# Altium schematic sheet PhotodiodeReceiverV1.SchDoc
size C; PageSetup: Record=PageOptions|CenterHorizontal=True|CenterVertical=True|PrintScale=1.06|XCorrection=1.00|YCorrection=1.00|PrintKind=1|BorderSize=5000000|LeftOffset=0|BottomOffset=0|Orientation=2|PaperLength=1000|PaperWidth=1000|Scale=100|PaperSource=7|PrintQuality=-3|MediaType=1|DitherType=10|PrintScaleMode=1|PaperKind=A3|PaperIndex=8
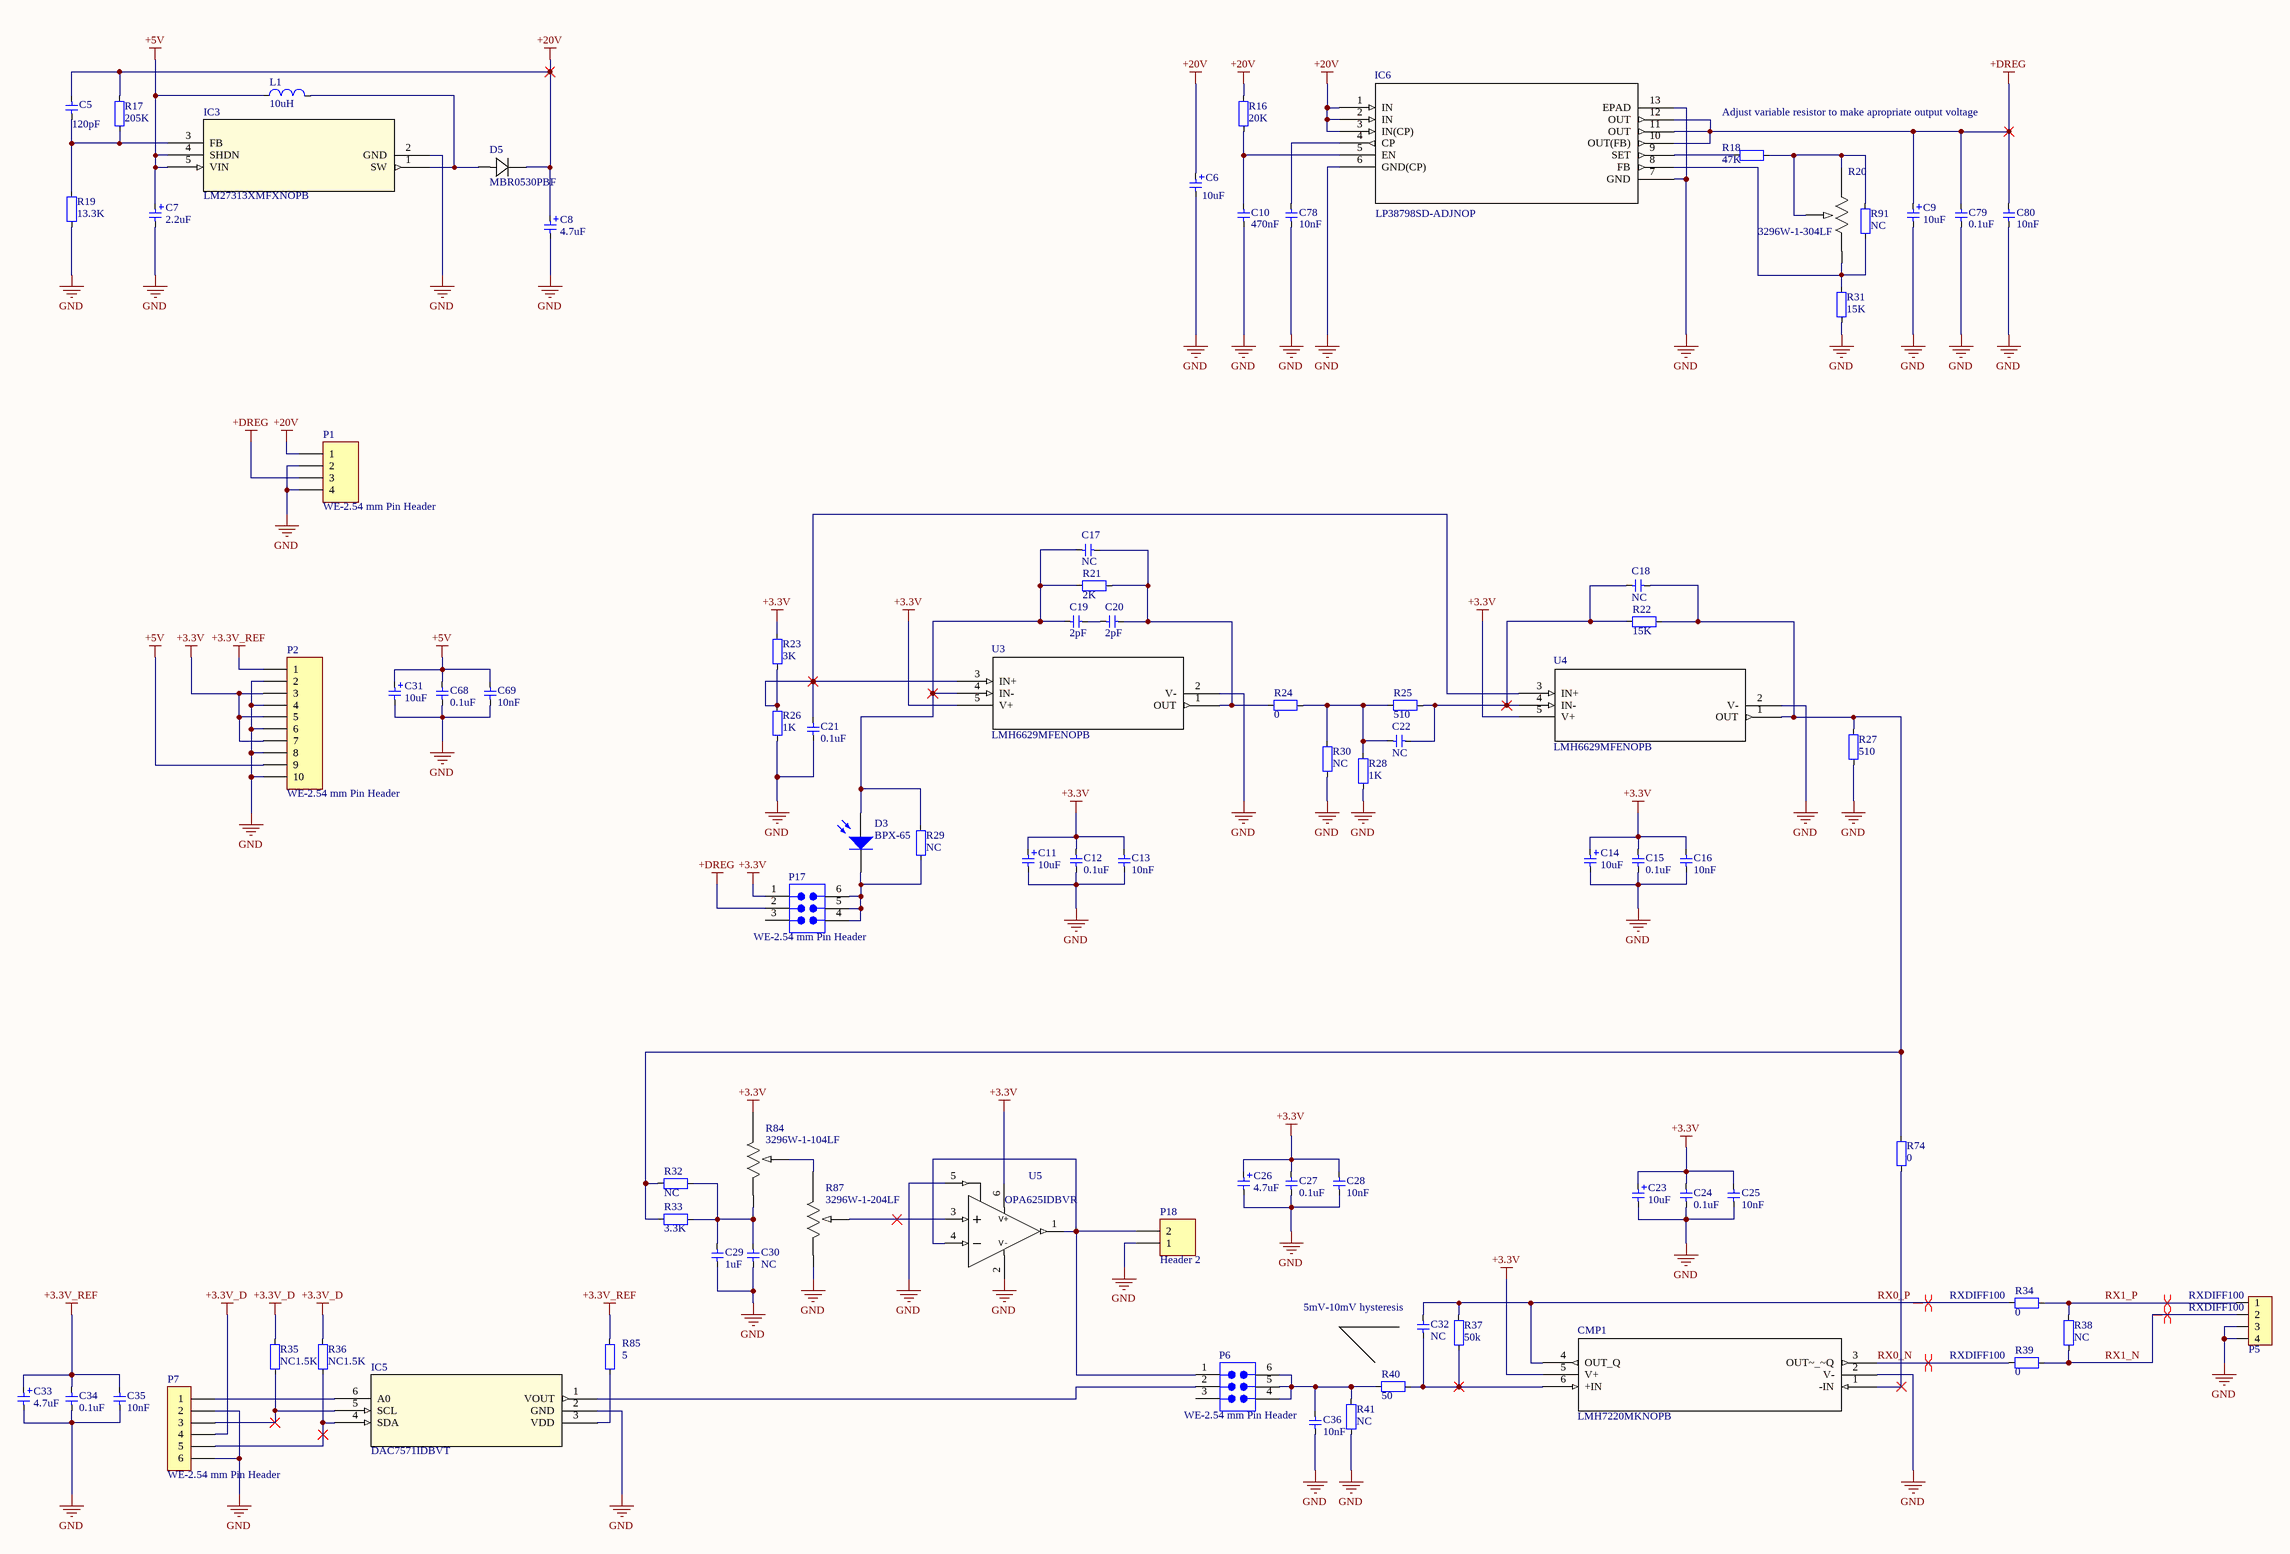
[diagram p0: PhotodiodeReceiverV1.SchDoc]

## Parts
C5  value 120pF  [CAP_0603]  (hidden comment: Cap_0603)
C6  value 10uF  [CAP_TAN_A1206]  (hidden comment: Cap_Tan_1206)
C7  value 2.2uF  [CAP_TAN_A1206]  (hidden comment: Cap_Tan_1206)
C8  value 4.7uF  [CAP_TAN_A1206]  (hidden comment: Cap_Tan_1206)
C9  value 10uF  [CAP_TAN_A1206]  (hidden comment: Cap_Tan_1206)
C10  value 470nF  [CAP_0805]  (hidden comment: Cap_0805)
C11  value 10uF  [CAP_TAN_A1206]  (hidden comment: Cap_Tan_1206)
C12  value 0.1uF  [CAP_0603]  (hidden comment: Cap_0603)
C13  value 10nF  [CAP_0603]  (hidden comment: Cap_0603)
C14  value 10uF  [CAP_TAN_A1206]  (hidden comment: Cap_Tan_1206)
C15  value 0.1uF  [CAP_0603]  (hidden comment: Cap_0603)
C16  value 10nF  [CAP_0603]  (hidden comment: Cap_0603)
C17  value NC  [CAP_0603]  (hidden comment: Cap_0603)
C18  value NC  [CAP_0603]  (hidden comment: Cap_0603)
C19  value 2pF  [CAP_0603]  (hidden comment: Cap_0603)
C20  value 2pF  [CAP_0603]  (hidden comment: Cap_0603)
C21  value 0.1uF  [CAP_0603]  (hidden comment: Cap_0603)
C22  value NC  [CAP_0603]  (hidden comment: Cap_0603)
C23  value 10uF  [CAP_TAN_A1206]  (hidden comment: Cap_Tan_1206)
C24  value 0.1uF  [CAP_0603]  (hidden comment: Cap_0603)
C25  value 10nF  [CAP_0603]  (hidden comment: Cap_0603)
C26  value 4.7uF  [CAP_TAN_A1206]  (hidden comment: Cap_Tan_1206)
C27  value 0.1uF  [CAP_0603]  (hidden comment: Cap_0603)
C28  value 10nF  [CAP_0603]  (hidden comment: Cap_0603)
C29  value 1uF  [CAP_0805]  (hidden comment: Cap_0805)
C30  value NC  [CAP_0805]  (hidden comment: Cap_0805)
C31  value 10uF  [CAP_TAN_A1206]  (hidden comment: Cap_Tan_1206)
C32  value NC  [CAP_0603]  (hidden comment: Cap_0603)
C33  value 4.7uF  [CAP_TAN_A1206]  (hidden comment: Cap_Tan_1206)
C34  value 0.1uF  [CAP_0603]  (hidden comment: Cap_0603)
C35  value 10nF  [CAP_0603]  (hidden comment: Cap_0603)
C36  value 10nF  [CAP_0603]  (hidden comment: Cap_0603)
C68  value 0.1uF  [CAP_0603]  (hidden comment: Cap_0603)
C69  value 10nF  [CAP_0603]  (hidden comment: Cap_0603)
C78  value 10nF  [CAP_0603]  (hidden comment: Cap_0603)
C79  value 0.1uF  [CAP_0603]  (hidden comment: Cap_0603)
C80  value 10nF  [CAP_0603]  (hidden comment: Cap_0603)
CMP1  LMH7220MKNOPB  [MK06A]
D3  BPX-65  [PIN2]
D5  MBR0530PBF  [DIODE_SOD123]
IC3  LM27313XMFXNOPB  [MF05A]
IC5  DAC7571IDBVT  [DBV6]
IC6  LP38798SD-ADJNOP  [DNT12]
L1  value 10uH  [IND_CD32]  (hidden comment: Ind_CD32)
P1  WE-2.54 mm Pin Header  [61000418221]
P2  WE-2.54 mm Pin Header  [61001018221]
P5  HDR1x4_2.54  [HDR1x4_2.54_180]  (value not drawn)
P6  WE-2.54 mm Pin Header  [610x0621121]
P7  WE-2.54 mm Pin Header  [61000618321]
P17  WE-2.54 mm Pin Header  [610x0621121]
P18  Header 2  [HDR1X2]
R16  value 20K  [RES_0603]  (hidden comment: Res_0603)
R17  value 205K  [RES_0805]  (hidden comment: Res_0805)
R18  value 47K  [RES_0603]  (hidden comment: Res_0603)
R19  value 13.3K  [RES_0603]  (hidden comment: Res_0603)
R20  3296W-1-304LF  [POT_3296W]
R21  value 2K  [RES_0603]  (hidden comment: Res_0603)
R22  value 15K  [RES_0603]  (hidden comment: Res_0603)
R23  value 3K  [RES_0603]  (hidden comment: Res_0603)
R24  value 0  [RES_0603]  (hidden comment: Res_0603)
R25  value 510  [RES_0603]  (hidden comment: Res_0603)
R26  value 1K  [RES_0603]  (hidden comment: Res_0603)
R27  value 510  [RES_0603]  (hidden comment: Res_0603)
R28  value 1K  [RES_0603]  (hidden comment: Res_0603)
R29  value NC  [RES_0603]  (hidden comment: Res_0603)
R30  value NC  [RES_0603]  (hidden comment: Res_0603)
R31  value 15K  [RES_0603]  (hidden comment: Res_0603)
R32  value NC  [RES_0805]  (hidden comment: Res_0805)
R33  value 3.3K  [RES_0805]  (hidden comment: Res_0805)
R34  value 0  [RES_0603]  (hidden comment: Res_0603)
R35  value NC1.5K  [RES_0603]  (hidden comment: Res_0603)
R36  value NC1.5K  [RES_0603]  (hidden comment: Res_0603)
R37  value 50k  [RES_0603]  (hidden comment: Res_0603)
R38  value NC  [RES_0603]  (hidden comment: Res_0603)
R39  value 0  [RES_0603]  (hidden comment: Res_0603)
R40  value 50  [RES_0603]  (hidden comment: Res_0603)
R41  value NC  [RES_0603]  (hidden comment: Res_0603)
R74  value 0  [RES_0603]  (hidden comment: Res_0603)
R84  3296W-1-104LF  [POT_3296W]
R85  value 5  [RES_0603]  (hidden comment: Res_0603)
R87  3296W-1-204LF  [POT_3296W]
R91  value NC  [RES_0603]  (hidden comment: Res_0603)
U3  LMH6629MFENOPB  [MF05A]
U4  LMH6629MFENOPB  [MF05A]
U5  OPA625IDBVR  [DBV0006A_N]

## Nets
+3.3V: C11.1 C12.2 C13.2 C14.1 C15.2 C16.2 C23.1 C24.2 C25.2 C26.1 C27.2 C28.2 CMP1.5(V+) P2.3 P2.5 P2.7 P17.1 R23.2 R84.3 U3.5(V+) U4.5(V+) U5.6(V+)
+3.3V_D: P7.4 R35.2 R36.2
+3.3V_REF: C33.1 C34.2 C35.2 P2.1 R85.2
+5V: C7.1 C31.1 C68.2 C69.2 IC3.4(SHDN) IC3.5(VIN) L1.1 P2.9
+20V: C5.2 C6.1 C8.1 D5.1 IC6.1(IN) IC6.2(IN) IC6.3(IN(CP)) P1.1 R16.1 R17.1
+DREG: C9.1 C79.2 C80.2 IC6.10(OUT(FB)) IC6.11(OUT) IC6.12(OUT) P1.3 P17.2
GND: C6.2 C7.2 C8.2 C9.2 C10.1 C11.2 C12.1 C13.1 C14.2 C15.1 C16.1 C21.1 C23.2 C24.1 C25.1 C26.2 C27.1 C28.1 C29.2 C30.2 C31.2 C33.2 C34.1 C35.1 C36.2 C68.1 C69.1 C78.1 C79.1 C80.1 CMP1.2(V-) IC3.2(GND) IC5.2(GND) IC6.6(GND(CP)) IC6.7(GND) IC6.13(EPAD) P1.2 P1.4 P2.2 P2.4 P2.6 P2.8 P2.10 P5.3 P5.4 P7.2 P7.6 P18.1 R19.1 R26.1 R27.2 R28.2 R30.2 R31.2 R41.1 R87.1 U3.2(V-) U4.2(V-) U5.2(V-) U5.5(MODE)
RX0_N: CMP1.3(OUT~_~Q) R39.2
RX0_P: C32.1 CMP1.4(OUT_Q) R34.1 R37.2
RX1_N: P5.2 R38.2 R39.1
RX1_P: P5.1 R34.2 R38.1
NetC5_1: C5.1 IC3.3(FB) R17.2 R19.2
NetC10_2: C10.2 IC6.5(EN) R16.2
NetC17_1: C17.1 C20.1 R21.1 R24.1 U3.1(OUT)
NetC17_2: C17.2 C19.2 D3.1(A) R21.2 R29.1 U3.4(IN-)
NetC18_1: C18.1 R22.1 R27.1 R32.2 R33.2 R74.2 U4.1(OUT)
NetC18_2: C18.2 C22.1 R22.2 R25.1 U4.4(IN-)
NetC19_1: C19.1 C20.2
NetC21_2: C21.2 R23.1 R26.2 U3.3(IN+) U4.3(IN+)
NetC22_2: C22.2 R24.2 R25.2 R28.1 R30.1
NetC29_1: C29.1 C30.1 R32.1 R33.1 R84.1
NetC32_2: C32.2 CMP1.6(+IN) R37.1 R40.2
NetC36_1: C36.1 P6.4 P6.5 P6.6 R40.1 R41.2
NetC78_2: C78.2 IC6.4(CP)
NetCMP1_1: CMP1.1(-IN) R74.1
NetD3_2: D3.2(K) P17.4 P17.5 P17.6 R29.2
NetD5_2: D5.2 IC3.1(SW) L1.2
NetIC5_1: IC5.1(VOUT) P6.2
NetIC5_3: IC5.3(VDD) R85.1
NetIC5_4: IC5.4(SDA) P7.5 R36.1
NetIC5_5: IC5.5(SCL) P7.3 R35.1
NetIC5_6: IC5.6(A0) P7.1
NetIC6_8: IC6.8(FB) R20.1 R31.1 R91.2
NetIC6_9: IC6.9(SET) R18.1
NetP6_1: P6.1 P18.2 U5.1(OUT) U5.4(IN-)
NetR18_2: R18.2 R20.2 R20.3 R91.1
NetR84_2: R84.2 R87.3
NetR87_2: R87.2 U5.3(IN+)

Not connected (* = marked no-connect by the designer): P6 3; P17 3

## Layout directives
differential pair; net class RXDIFF100: RX0_N, RX0_P, RX1_N, RX1_P

## Notes on the sheet
- (near R18) Adjust variable resistor to make apropriate output voltage
- (near C32) 5mV-10mV hysteresis

## Library data of the parts
C5 C12 C13 C15-C22 C24 C25 C27 C28 C32 C34-C36 C68 C69 C78-C80 = Cap_0603: Capacitor
C6-C9 C11 C14 C23 C26 C31 C33 = Cap_Tan_1206: Capacitor
C10 C29 C30 = Cap_0805: Capacitor
CMP1 = LMH7220MKNOPB: Imported; Manufacturer_Part_Number: LMH7220MK/NOPB; CompType: OpAmpIC; Vendor: National Semiconductor; Symbol: NameLMH7220MK; 3D_Library_Name: National_Amplifiers; C: Copyright (C) 2015 Accelerated Designs. All rights reserved; Type: DEV; Version: 1; base_pn: LMH7220; Copyright: Copyright (C) 2015 Accelerated Designs. All rights reserved; RefDes: RefDes; Value: Value
D3 = Photo Sen: Photosensitive Diode; Published: 24-Mar-1999; LatestRevisionDate: 17-Jul-2002; LatestRevisionNote: Re-released for DXP Platform.; PackageReference: PIN2; Publisher: Altium Limited
D5 = MBR0530PBF: Imported; Vendor: Vishay; Supersection: Semiconductors; Section: Discretes; Type: DEV; C: Copyright (C) 2015 Accelerated Designs. All rights reserved; Manufacturer_Part_Number: MBR0530PBF; Family: Rectifier; Manufacturer_Name: Vishay; RS Part Number: 7000868; Copyright: Copyright (C) 2015 Accelerated Designs. All rights reserved; RefDes: RefDes; Value: Value
IC3 = LM27313XMFXNOPB: Imported; Part: No; Manufacturer_Part_Number: LM27313XMFX/NOPB; CompType: Switcher; Vendor: National Semiconductor; Vendor2: NationalSemiconductor; Version2: 1; Symbol: NameLM27313XMF; 3D_Library_Name: National_Switchers; C: Copyright (C) 2015 Accelerated Designs. All rights reserved; Type: DEV; Version: 05/02/2007; CompType2: Switcher; base_pn: LM27313; Copyright: Copyright (C) 2015 Accelerated Designs. All rights reserved; RefDes: RefDes; Value: Value
IC5 = DAC7571IDBVT: Imported; Vendor: Texas Instruments; Section: Data Converters; C: Copyright (C) 2015 Accelerated Designs. All rights reserved; Manufacturer_Part_Number: DAC7571IDBVT; Family: DAC; Manufacturer_Name: Texas Instruments; RS Part Number: 4615971; Copyright: Copyright (C) 2015 Accelerated Designs. All rights reserved; RefDes: RefDes; Type: DEV; Value: Value
IC6 = LP38798SD-ADJNOP: Imported; Manufacturer_Part_Number: lp38798sd-adj/nopb; Vendor: TEXAS INSTRUMENTS; C: Copyright (C) 2015 Accelerated Designs. All rights reserved; Copyright: Copyright (C) 2015 Accelerated Designs. All rights reserved; RefDes: RefDes; Type: DEV; Value: Value
L1 = Ind_CD32: Inductor
P1 = WE-2.54 mm Pin Header & Jumper 61000418221: WR-PHD 2.54 mm SMT Pin Header; Manufacturer: WЁ№rth Elektronik eiSos GmbH; ComponentLink1 Description: Manufacturer; ComponentLink2 Description: Datasheet; NoPins: 04; Created Date: 26 March 2013; partNo: 61000418221; ComponentLink1URL: http://www.we-online.com; ComponentLink2URL: http://katalog.we-online.de/em/datasheet/6100xx18221.pdf; Created by: Karrer Zheng
P2 = WE-2.54 mm Pin Header & Jumper 61001018221: WR-PHD 2.54 mm SMT Pin Header; Manufacturer: WЁ№rth Elektronik eiSos GmbH; ComponentLink1 Description: Manufacturer; ComponentLink2 Description: Datasheet; NoPins: 10; Created Date: 26 March 2013; partNo: 61001018221; ComponentLink1URL: http://www.we-online.com; ComponentLink2URL: http://katalog.we-online.de/em/datasheet/6100xx18221.pdf; Created by: Karrer Zheng
P5 = HDR1x4_2.54: Header
P6 P17 = WE-2.54 mm Pin Header & Jumper 610x0621121: WR-PHD 2.54 mm Dual SMT Pin Header; Manufacturer: WЁ№rth Elektronik eiSos GmbH; ComponentLink1 Description: Manufacturer; ComponentLink2 Description: Datasheet; NoPins: 06; Created Date: 22 March 2013; partNo: 610x0621121; ComponentLink1URL: http://www.we-online.com; ComponentLink2URL: http://katalog.we-online.de/em/datasheet/6100xx21121.pdf; Created by: Karrer Zheng
P7 = WE-2.54 mm Pin Header & Jumper 61000618321: WR-PHD 2.54 mm SMT Pin Header; Manufacturer: WЁ№rth Elektronik eiSos GmbH; ComponentLink1 Description: Manufacturer; ComponentLink2 Description: Datasheet; NoPins: 06; Created Date: 26 March 2013; partNo: 61000618321; ComponentLink1URL: http://www.we-online.com; ComponentLink2URL: http://katalog.we-online.de/em/datasheet/6100xx18221.pdf; Created by: Karrer Zheng
P18 = Header 2: Header, 2-Pin; LatestRevisionDate: 17-Jul-2002; LatestRevisionNote: Re-released for DXP Platform.; Publisher: Altium Limited
R16 R18 R19 R21-R31 R34-R41 R74 R85 R91 = Res_0603: Resistor
R17 R32 R33 = Res_0805: Resistor
R20 R84 R87 = 3296W-1-503LF: Imported; Vendor: Bourns Electronics; HEADER_SECTION: Passives; HEADER_GROUP: Resistors; R-S_Number: 5219805; Tolerance: 10%; Voltage: Unknown; C: Copyright (C) 2015 Accelerated Designs. All rights reserved; Manufacturer_Part_Number: 3296W-1-503LF; Manufacturer_Name: Bourns Electronics; Mounting: Through Hole; Value: Value; Package/Case: Unknown; Current Rating: Unknown; Copyright: Copyright (C) 2015 Accelerated Designs. All rights reserved; RefDes: RefDes; Type: DEV
U3 U4 = LMH6629MFENOPB: Imported; Manufacturer: Texas Instruments; Manufacturer_Part_Number: lmh6629_dbv_5; Vendor: National Semiconductor; C: Copyright (C) 2015 Accelerated Designs. All rights reserved; DatasheetURL: http://www.ti.com/lit/ds/symlink/lmh6629.pdf; basePN: LMH6629; NSC_PackageReference: MF05A; Copyright: Copyright (C) 2015 Accelerated Designs. All rights reserved; RefDes: RefDes; Type: DEV; Value: Value
U5 = OPA625IDBVR: Imported; Alternate PartNumber: OPA625IDBVT; Manufacturer: Texas Instruments; CompType: IC; PIN_COUNT: 6; PartNumber: OPA625IDBVR; PackageReference: DBV0006A; MountType: SMT; RoHS: Y; RefDes: RefDes; Type: DEV; Value: Value